# EasyEDA schematic SCH.json
TITLE: Sheet_1; REV: 1.0; Date: 2024-04-12; Sheet: 1/1; Drawn By: michael.s.panait09; Company: Your Company
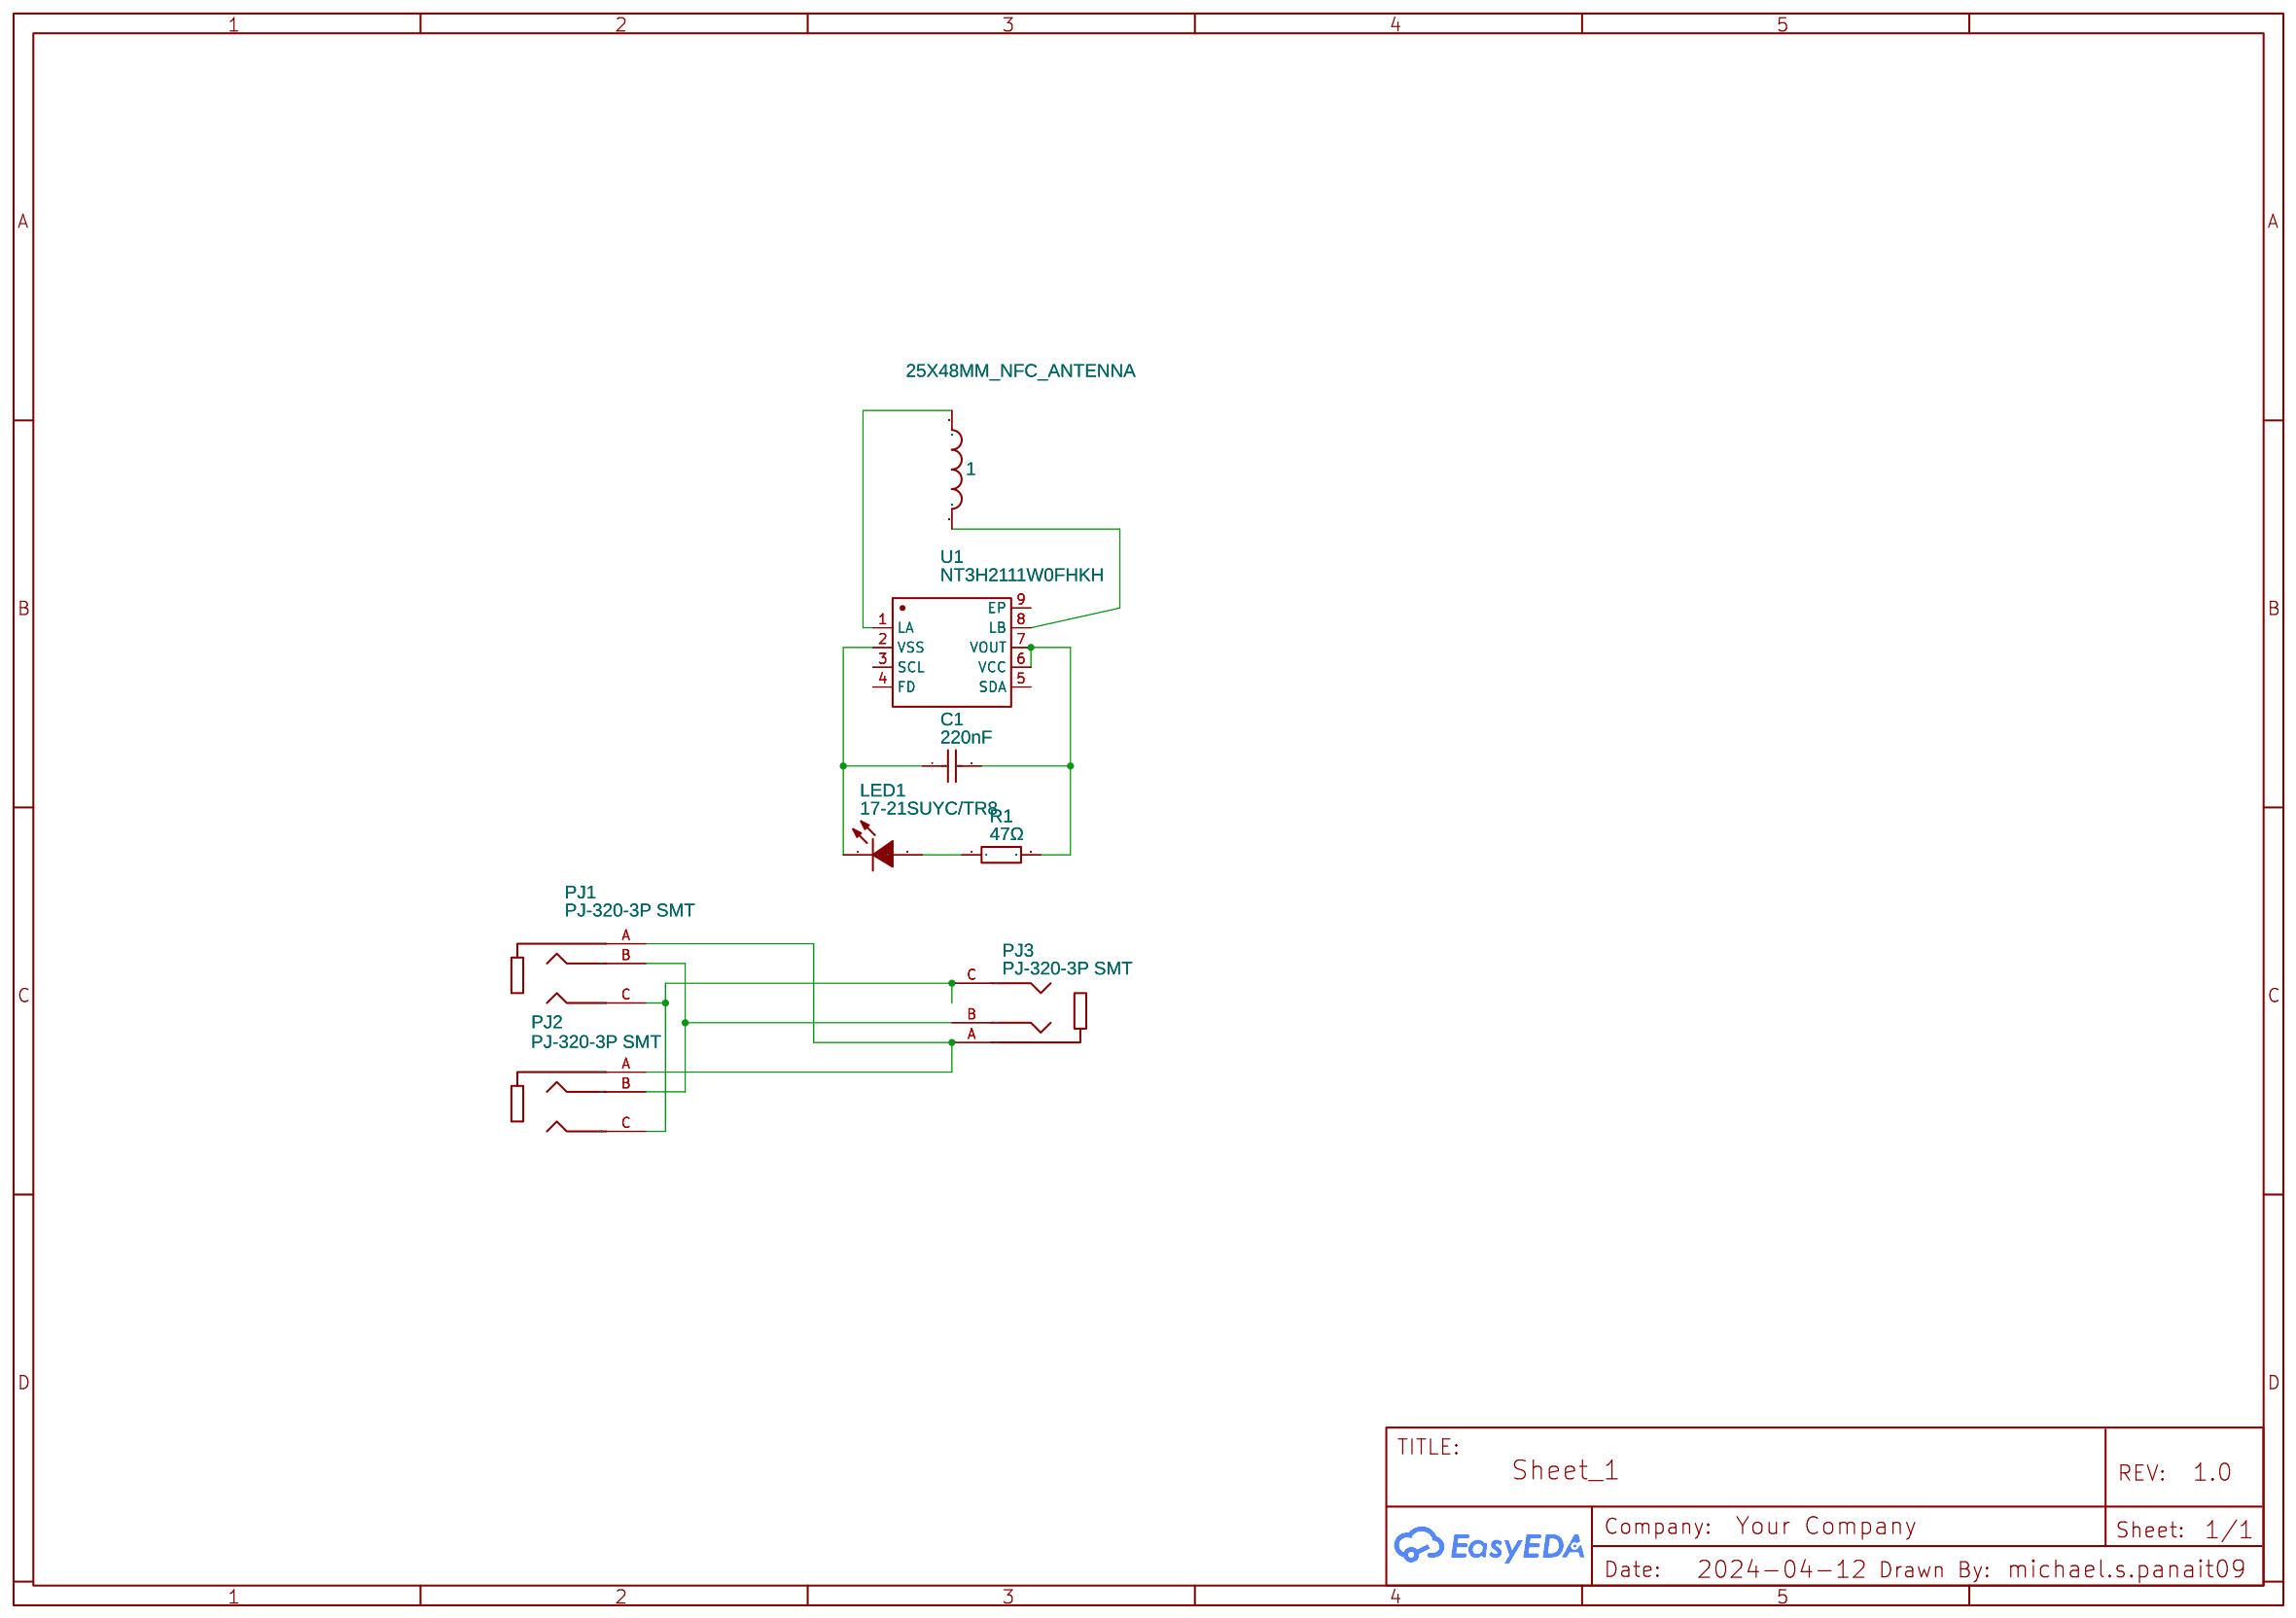
[diagram p0: schematic sheet]

## Parts
1  25X48MM_NFC_ANTENNA  [25X48MM_NFC_ANTENNA]
C1  220nF  [C0603]
LED1  17-21SUYC/TR8  [LED0805-R-RD]
PJ1  PJ-320-3P SMT  [AUDIO-SMD_PJ-320-3P-SMT]
PJ2  PJ-320-3P SMT  [AUDIO-SMD_PJ-320-3P-SMT]
PJ3  PJ-320-3P SMT  [AUDIO-SMD_PJ-320-3P-SMT]
R1  47Ω  [R0603]
U1  NT3H2111W0FHKH  [XQFN-8_L1.6-W1.6-P0.50-BL]

## Library data of the parts
1 = 25X48MM_NFC_ANTENNA: Contributor: dnonoo
C1 = CL10B224KA8NNNC: Supplier: LCSC; Manufacturer: SAMSUNG(三星); Supplier Part: C21120; JLCPCB Part Class: Basic Part
LED1 = 17-21SUYC/TR8: Supplier: LCSC; Manufacturer: KENTO; Manufacturer Part: KT-0805黄灯; Supplier Part: C2296; JLCPCB Part Class: Basic Part
PJ1-PJ3 = PJ-320-3P SMT: Supplier: LCSC; Supplier Part: C17701688; Manufacturer: SHOU HAN(首韩); Contributor: lcsc; JLCPCB Part Class: Extended Part
R1 = 0603WAF470JT5E: Supplier: LCSC; Manufacturer: UNI-ROYAL(厚声); Supplier Part: C23182; JLCPCB Part Class: Basic Part
U1 = NT3H2111W0FHKH: Contributor: LCSC; Supplier: LCSC; Supplier Part: C710403; Manufacturer: NXP(恩智浦); JLCPCB Part Class: Extended Part

## Nets
Net-(1-P$1): 1.P$1 U1.1(LA)
Net-(1-P$2): 1.P$2 U1.8(LB)
Net-(C1-1): C1.1 LED1.2(-) U1.2(VSS)
Net-(C1-2): C1.2 R1.2 U1.6(VCC) U1.7(VOUT)
Net-(LED1-1): LED1.1(+) R1.1
Net-(PJ1-A): PJ1.A PJ2.A PJ3.A
Net-(PJ1-B): PJ1.B PJ2.B PJ3.B
Net-(PJ1-C): PJ1.C PJ2.C PJ3.C

Not connected (* = marked no-connect by the designer): U1 3(SCL) 4(FD) 5(SDA) 9(EP)
